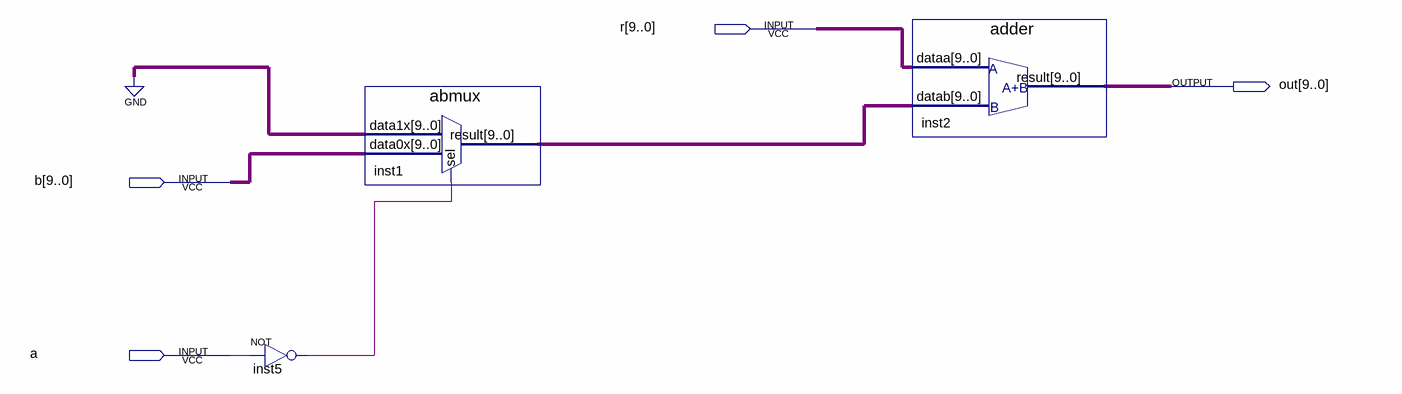
[diagram p0: schematic sheet]
// Quartus schematic addselection.bdf as structural Verilog: 3 symbols, 4 pins
module addselection (
  input  [9:0] r,
  input  [9:0] b,
  input  a,
  output [9:0] out
);

  wire inst5_out;
  wire [9:0] inst1_result;

  not inst5 (inst5_out, a);
  abmux inst1 (.data1x({10{1'b0}}), .data0x(b), .sel(inst5_out), .result(inst1_result));
  adder inst2 (.dataa(r), .datab(inst1_result), .result(out));
endmodule
